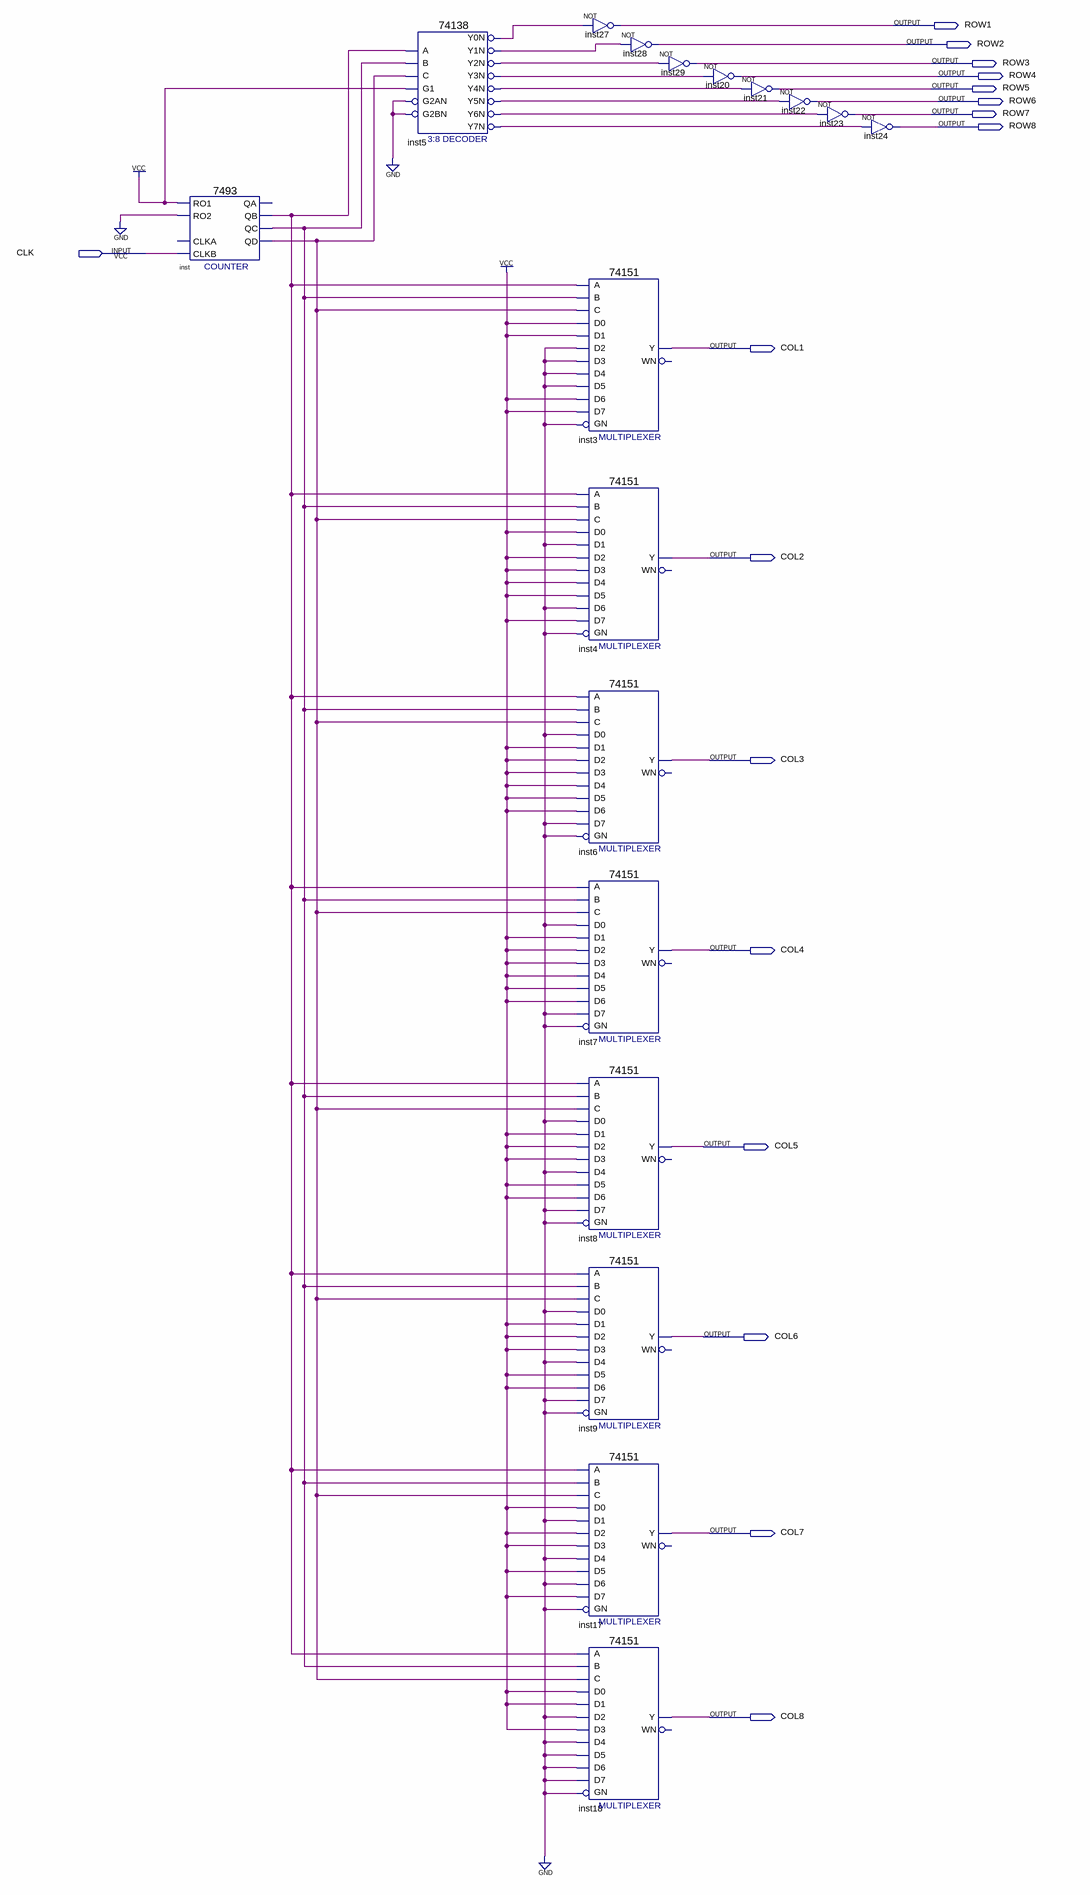
[diagram p0: schematic sheet]
// Quartus schematic matrix.bdf as structural Verilog: 18 symbols, 17 pins
module matrix (
  input  CLK,
  output ROW1,
  output ROW2,
  output ROW3,
  output ROW4,
  output ROW5,
  output ROW6,
  output ROW7,
  output ROW8,
  output COL1,
  output COL2,
  output COL3,
  output COL4,
  output COL5,
  output COL6,
  output COL7,
  output COL8
);

  wire inst5_y0n, inst5_y1n, inst5_y2n, inst5_y3n, inst5_y4n, inst5_y5n, inst5_y6n, inst5_y7n, inst_qb,
       inst_qc, inst_qd;

  \7493  inst (.RO1(1'b1), .RO2(1'b0), .CLKB(CLK), .QC(inst_qc), .QB(inst_qb), .QD(inst_qd));  // open: CLKA, QA
  \74138  inst5 (
    .A(inst_qb), .B(inst_qc), .G1(1'b1), .C(inst_qd), .G2AN(1'b0), .G2BN(1'b0), .Y0N(inst5_y0n),
    .Y1N(inst5_y1n), .Y2N(inst5_y2n), .Y3N(inst5_y3n), .Y4N(inst5_y4n), .Y5N(inst5_y5n), .Y6N(inst5_y6n),
    .Y7N(inst5_y7n));
  not inst27 (ROW1, inst5_y0n);
  \74151  inst3 (
    .GN(1'b0), .C(inst_qd), .B(inst_qc), .A(inst_qb), .D5(1'b0), .D0(1'b1), .D1(1'b1), .D4(1'b0), .D3(1'b0),
    .D2(1'b0), .D6(1'b1), .D7(1'b1), .Y(COL1));  // open: WN
  \74151  inst4 (
    .GN(1'b0), .C(inst_qd), .B(inst_qc), .A(inst_qb), .D5(1'b1), .D0(1'b1), .D1(1'b0), .D4(1'b1), .D3(1'b1),
    .D2(1'b1), .D6(1'b0), .D7(1'b1), .Y(COL2));  // open: WN
  \74151  inst6 (
    .GN(1'b0), .C(inst_qd), .B(inst_qc), .A(inst_qb), .D5(1'b1), .D0(1'b0), .D1(1'b1), .D4(1'b1), .D3(1'b1),
    .D2(1'b1), .D6(1'b1), .D7(1'b0), .Y(COL3));  // open: WN
  \74151  inst7 (
    .GN(1'b0), .C(inst_qd), .B(inst_qc), .A(inst_qb), .D5(1'b1), .D0(1'b0), .D1(1'b1), .D4(1'b1), .D3(1'b1),
    .D2(1'b1), .D6(1'b1), .D7(1'b0), .Y(COL4));  // open: WN
  \74151  inst8 (
    .GN(1'b0), .C(inst_qd), .B(inst_qc), .A(inst_qb), .D5(1'b1), .D0(1'b0), .D1(1'b1), .D4(1'b0), .D3(1'b1),
    .D2(1'b1), .D6(1'b1), .D7(1'b0), .Y(COL5));  // open: WN
  \74151  inst9 (
    .GN(1'b0), .C(inst_qd), .B(inst_qc), .A(inst_qb), .D5(1'b1), .D0(1'b0), .D1(1'b1), .D4(1'b0), .D3(1'b1),
    .D2(1'b1), .D6(1'b1), .D7(1'b0), .Y(COL6));  // open: WN
  \74151  inst17 (
    .GN(1'b0), .C(inst_qd), .B(inst_qc), .A(inst_qb), .D5(1'b1), .D0(1'b1), .D1(1'b0), .D4(1'b0), .D3(1'b1),
    .D2(1'b1), .D6(1'b0), .D7(1'b1), .Y(COL7));  // open: WN
  \74151  inst18 (
    .GN(1'b0), .C(inst_qd), .B(inst_qc), .A(inst_qb), .D5(1'b0), .D0(1'b1), .D1(1'b1), .D4(1'b0), .D3(1'b1),
    .D2(1'b0), .D6(1'b0), .D7(1'b0), .Y(COL8));  // open: WN
  not inst28 (ROW2, inst5_y1n);
  not inst29 (ROW3, inst5_y2n);
  not inst20 (ROW4, inst5_y3n);
  not inst21 (ROW5, inst5_y4n);
  not inst22 (ROW6, inst5_y5n);
  not inst23 (ROW7, inst5_y6n);
  not inst24 (ROW8, inst5_y7n);
endmodule
